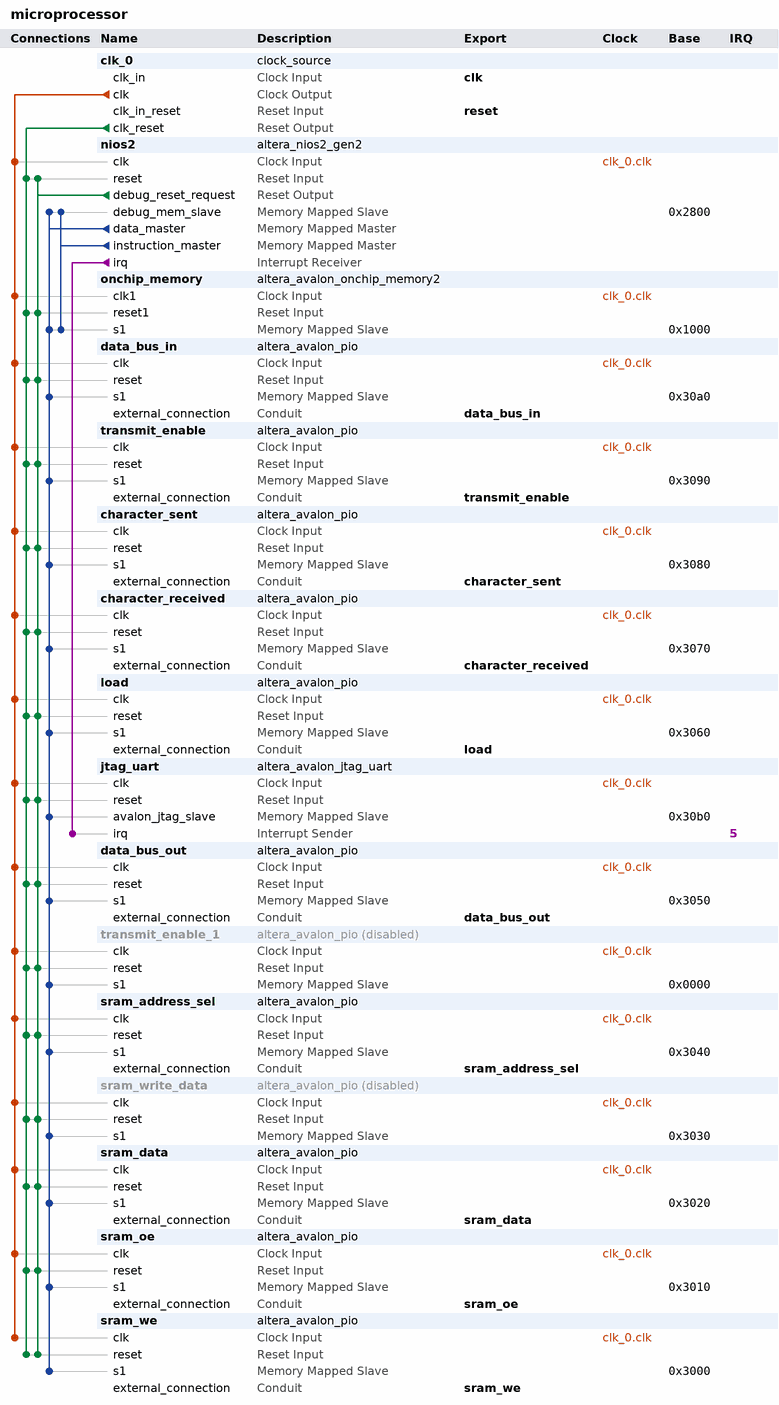
[diagram p0: system contents]
# Platform Designer (Qsys) system microprocessor, Cyclone V 5CSEMA5F31C6
# Parameters at their usual value, and those the tool derives, are not listed.
package require -exact qsys 16.0
create_system microprocessor
set_project_property DEVICE_FAMILY {Cyclone V}
set_project_property DEVICE 5CSEMA5F31C6

add_instance clk_0 clock_source 16.0
set_instance_parameter_value clk_0 clockFrequency 50000000

add_instance nios2 altera_nios2_gen2 16.0
set_instance_parameter_value nios2 dcache_size 2048
set_instance_parameter_value nios2 exceptionSlave onchip_memory.s1
set_instance_parameter_value nios2 icache_size 4096
set_instance_parameter_value nios2 impl Tiny
set_instance_parameter_value nios2 resetSlave onchip_memory.s1

add_instance onchip_memory altera_avalon_onchip_memory2 16.0
set_instance_parameter_value onchip_memory dataWidth 32
set_instance_parameter_value onchip_memory dualPort false
set_instance_parameter_value onchip_memory initMemContent true
set_instance_parameter_value onchip_memory initializationFileName onchip_mem.hex
set_instance_parameter_value onchip_memory memorySize 4096

add_instance data_bus_in altera_avalon_pio 16.0
set_instance_parameter_value data_bus_in direction Input
set_instance_parameter_value data_bus_in width 8

add_instance transmit_enable altera_avalon_pio 16.0
set_instance_parameter_value transmit_enable direction Output
set_instance_parameter_value transmit_enable width 1

add_instance character_sent altera_avalon_pio 16.0
set_instance_parameter_value character_sent direction Input
set_instance_parameter_value character_sent width 1

add_instance character_received altera_avalon_pio 16.0
set_instance_parameter_value character_received direction Input
set_instance_parameter_value character_received width 1

add_instance load altera_avalon_pio 16.0
set_instance_parameter_value load direction Output
set_instance_parameter_value load width 1

add_instance jtag_uart altera_avalon_jtag_uart 16.0
set_instance_parameter_value jtag_uart simInteractiveOptions NO_INTERACTIVE_WINDOWS

add_instance data_bus_out altera_avalon_pio 16.0
set_instance_parameter_value data_bus_out direction Output
set_instance_parameter_value data_bus_out width 8

add_instance transmit_enable_1 altera_avalon_pio 16.0
set_instance_property transmit_enable_1 ENABLED false
set_instance_parameter_value transmit_enable_1 direction Output
set_instance_parameter_value transmit_enable_1 width 1

add_instance sram_address_sel altera_avalon_pio 16.0
set_instance_parameter_value sram_address_sel direction Output
set_instance_parameter_value sram_address_sel width 8

add_instance sram_write_data altera_avalon_pio 16.0
set_instance_property sram_write_data ENABLED false
set_instance_parameter_value sram_write_data direction Input
set_instance_parameter_value sram_write_data width 32

add_instance sram_data altera_avalon_pio 16.0
set_instance_parameter_value sram_data direction InOut
set_instance_parameter_value sram_data width 32

add_instance sram_oe altera_avalon_pio 16.0
set_instance_parameter_value sram_oe direction Output
set_instance_parameter_value sram_oe width 1

add_instance sram_we altera_avalon_pio 16.0
set_instance_parameter_value sram_we direction Output
set_instance_parameter_value sram_we width 1

# connections
add_connection clk_0.clk character_received.clk clock
add_connection clk_0.clk character_sent.clk clock
add_connection clk_0.clk data_bus_in.clk clock
add_connection clk_0.clk data_bus_out.clk clock
add_connection clk_0.clk jtag_uart.clk clock
add_connection clk_0.clk load.clk clock
add_connection clk_0.clk nios2.clk clock
add_connection clk_0.clk onchip_memory.clk1 clock
add_connection clk_0.clk sram_address_sel.clk clock
add_connection clk_0.clk sram_data.clk clock
add_connection clk_0.clk sram_oe.clk clock
add_connection clk_0.clk sram_we.clk clock
add_connection clk_0.clk sram_write_data.clk clock
add_connection clk_0.clk transmit_enable.clk clock
add_connection clk_0.clk transmit_enable_1.clk clock
add_connection clk_0.clk_reset character_received.reset reset
add_connection clk_0.clk_reset character_sent.reset reset
add_connection clk_0.clk_reset data_bus_in.reset reset
add_connection clk_0.clk_reset data_bus_out.reset reset
add_connection clk_0.clk_reset jtag_uart.reset reset
add_connection clk_0.clk_reset load.reset reset
add_connection clk_0.clk_reset nios2.reset reset
add_connection clk_0.clk_reset onchip_memory.reset1 reset
add_connection clk_0.clk_reset sram_address_sel.reset reset
add_connection clk_0.clk_reset sram_data.reset reset
add_connection clk_0.clk_reset sram_oe.reset reset
add_connection clk_0.clk_reset sram_we.reset reset
add_connection clk_0.clk_reset sram_write_data.reset reset
add_connection clk_0.clk_reset transmit_enable.reset reset
add_connection clk_0.clk_reset transmit_enable_1.reset reset
add_connection nios2.debug_reset_request character_received.reset reset
add_connection nios2.debug_reset_request character_sent.reset reset
add_connection nios2.debug_reset_request data_bus_in.reset reset
add_connection nios2.debug_reset_request data_bus_out.reset reset
add_connection nios2.debug_reset_request jtag_uart.reset reset
add_connection nios2.debug_reset_request load.reset reset
add_connection nios2.debug_reset_request nios2.reset reset
add_connection nios2.debug_reset_request onchip_memory.reset1 reset
add_connection nios2.debug_reset_request sram_address_sel.reset reset
add_connection nios2.debug_reset_request sram_data.reset reset
add_connection nios2.debug_reset_request sram_oe.reset reset
add_connection nios2.debug_reset_request sram_we.reset reset
add_connection nios2.debug_reset_request sram_write_data.reset reset
add_connection nios2.debug_reset_request transmit_enable.reset reset
add_connection nios2.debug_reset_request transmit_enable_1.reset reset
add_connection nios2.data_master character_received.s1 avalon
set_connection_parameter_value nios2.data_master/character_received.s1 baseAddress 0x3070
add_connection nios2.data_master character_sent.s1 avalon
set_connection_parameter_value nios2.data_master/character_sent.s1 baseAddress 0x3080
add_connection nios2.data_master data_bus_in.s1 avalon
set_connection_parameter_value nios2.data_master/data_bus_in.s1 baseAddress 0x30a0
add_connection nios2.data_master data_bus_out.s1 avalon
set_connection_parameter_value nios2.data_master/data_bus_out.s1 baseAddress 0x3050
add_connection nios2.data_master jtag_uart.avalon_jtag_slave avalon
set_connection_parameter_value nios2.data_master/jtag_uart.avalon_jtag_slave baseAddress 0x30b0
add_connection nios2.data_master load.s1 avalon
set_connection_parameter_value nios2.data_master/load.s1 baseAddress 0x3060
add_connection nios2.data_master nios2.debug_mem_slave avalon
set_connection_parameter_value nios2.data_master/nios2.debug_mem_slave baseAddress 0x2800
add_connection nios2.data_master onchip_memory.s1 avalon
set_connection_parameter_value nios2.data_master/onchip_memory.s1 baseAddress 0x1000
add_connection nios2.data_master sram_address_sel.s1 avalon
set_connection_parameter_value nios2.data_master/sram_address_sel.s1 baseAddress 0x3040
add_connection nios2.data_master sram_data.s1 avalon
set_connection_parameter_value nios2.data_master/sram_data.s1 baseAddress 0x3020
add_connection nios2.data_master sram_oe.s1 avalon
set_connection_parameter_value nios2.data_master/sram_oe.s1 baseAddress 0x3010
add_connection nios2.data_master sram_we.s1 avalon
set_connection_parameter_value nios2.data_master/sram_we.s1 baseAddress 0x3000
add_connection nios2.data_master sram_write_data.s1 avalon
set_connection_parameter_value nios2.data_master/sram_write_data.s1 baseAddress 0x3030
add_connection nios2.data_master transmit_enable.s1 avalon
set_connection_parameter_value nios2.data_master/transmit_enable.s1 baseAddress 0x3090
add_connection nios2.data_master transmit_enable_1.s1 avalon
set_connection_parameter_value nios2.data_master/transmit_enable_1.s1 baseAddress 0x0000
add_connection nios2.instruction_master nios2.debug_mem_slave avalon
set_connection_parameter_value nios2.instruction_master/nios2.debug_mem_slave baseAddress 0x2800
add_connection nios2.instruction_master onchip_memory.s1 avalon
set_connection_parameter_value nios2.instruction_master/onchip_memory.s1 baseAddress 0x1000
add_connection nios2.irq jtag_uart.irq interrupt
set_connection_parameter_value nios2.irq/jtag_uart.irq irqNumber 5

# exported interfaces
add_interface character_received conduit end
set_interface_property character_received EXPORT_OF character_received.external_connection
add_interface character_sent conduit end
set_interface_property character_sent EXPORT_OF character_sent.external_connection
add_interface clk clock sink
set_interface_property clk EXPORT_OF clk_0.clk_in
add_interface data_bus_in conduit end
set_interface_property data_bus_in EXPORT_OF data_bus_in.external_connection
add_interface data_bus_out conduit end
set_interface_property data_bus_out EXPORT_OF data_bus_out.external_connection
add_interface load conduit end
set_interface_property load EXPORT_OF load.external_connection
add_interface reset reset sink
set_interface_property reset EXPORT_OF clk_0.clk_in_reset
add_interface sram_address_sel conduit end
set_interface_property sram_address_sel EXPORT_OF sram_address_sel.external_connection
add_interface sram_data conduit end
set_interface_property sram_data EXPORT_OF sram_data.external_connection
add_interface sram_oe conduit end
set_interface_property sram_oe EXPORT_OF sram_oe.external_connection
add_interface sram_we conduit end
set_interface_property sram_we EXPORT_OF sram_we.external_connection
add_interface transmit_enable conduit end
set_interface_property transmit_enable EXPORT_OF transmit_enable.external_connection

set_interconnect_requirement {$system} qsys_mm.clockCrossingAdapter HANDSHAKE
set_interconnect_requirement {$system} qsys_mm.enableEccProtection FALSE
set_interconnect_requirement {$system} qsys_mm.insertDefaultSlave FALSE
set_interconnect_requirement {$system} qsys_mm.maxAdditionalLatency 1

save_system microprocessor.qsys
